# EAGLE design pcb (EAGLE 7.6.0)
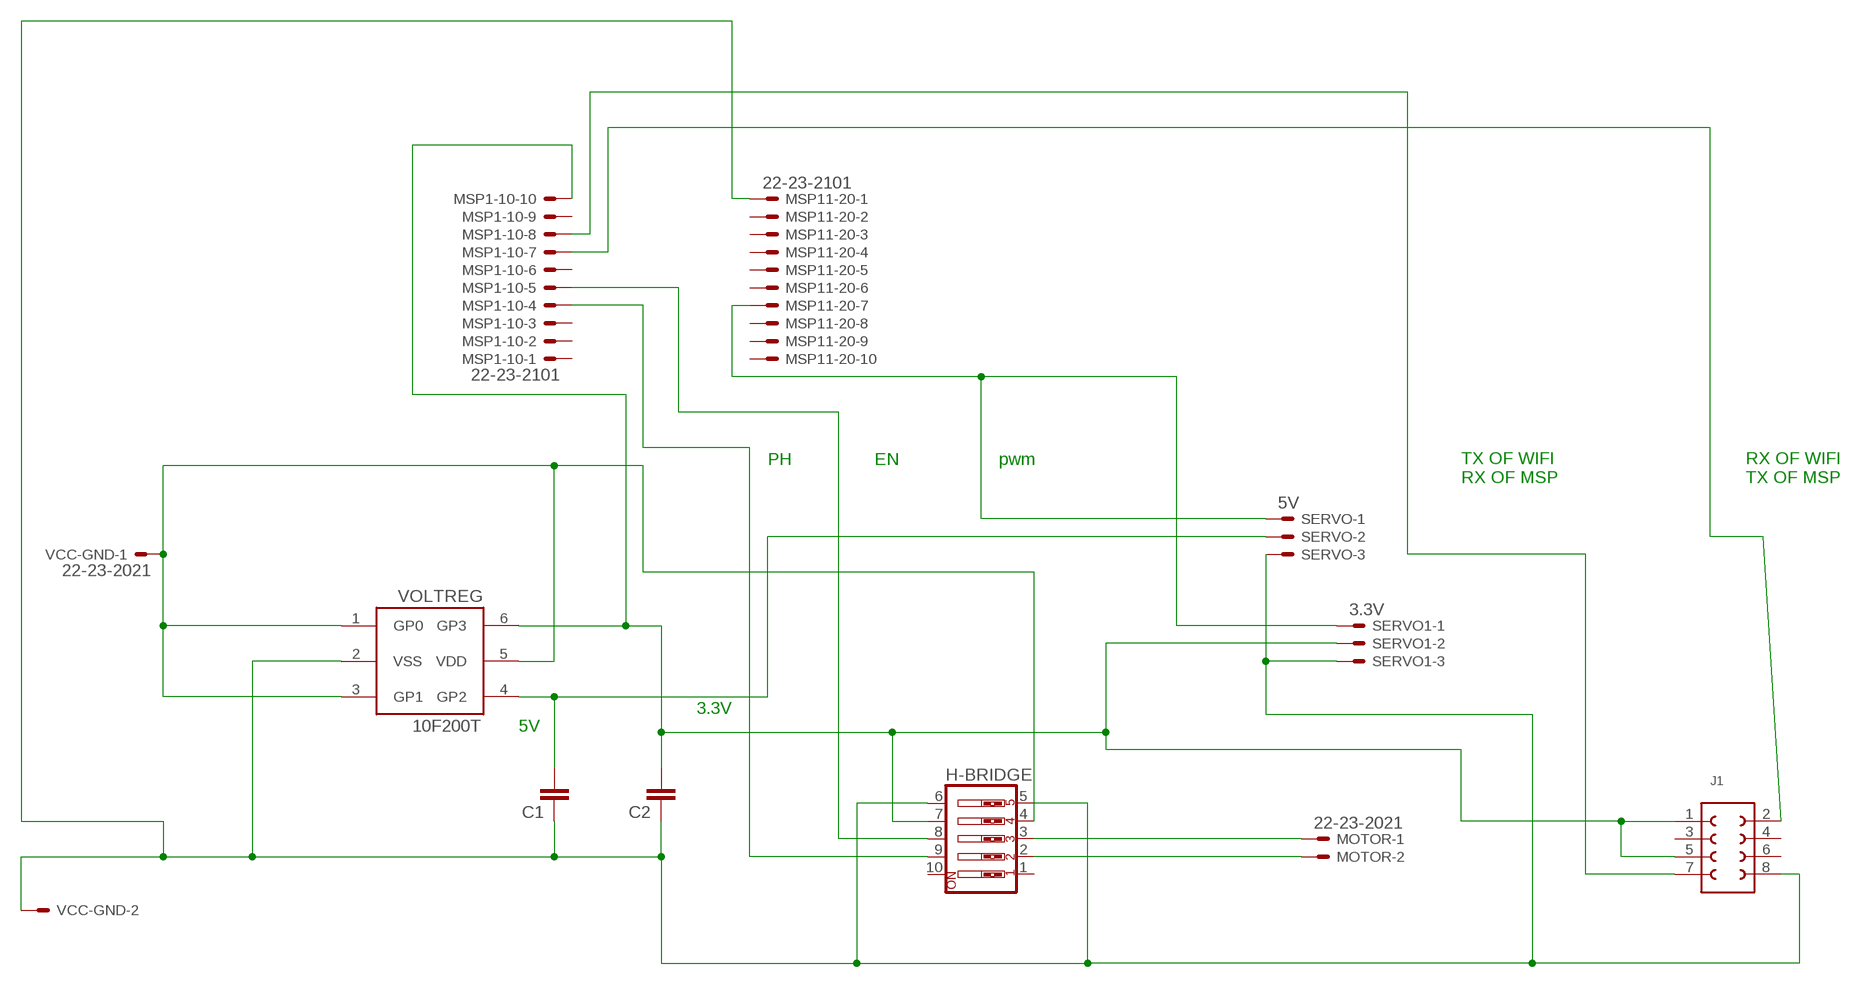
[diagram p0: schematic, sheet 1]

## Parts
C1  C2,5-3  [C2.5-3]
C2  C2,5-3  [C2.5-3]
H-BRIDGE  SW_DIP-5  [EDG-05]
J1  61300821121  [61300821121]
MOTOR  22-23-2021  [22-23-2021]
MSP1-10  22-23-2101  [22-23-2101]
MSP11-20  22-23-2101  [22-23-2101]
SERVO  5V  22-23-2031  [22-23-2031]
SERVO1  3.3V  22-23-2031  [22-23-2031]
VCC-GND  22-23-2021  [22-23-2021]
VOLTREG  10F200T  [SOT23-6]

## Nets
N$1: J1.2 MSP1-10.7
N$3: J1.7 MSP1-10.8
N$4: C2.2 H-BRIDGE.7 J1.1 J1.5 MSP1-10.10 SERVO1.2 VOLTREG.6(GP3)
N$5: H-BRIDGE.3 MOTOR.1
N$6: H-BRIDGE.2 MOTOR.2
N$7: MSP11-20.7 SERVO1.1 SERVO.1
N$10: C1.2 SERVO.2 VOLTREG.4(GP2)
N$11: H-BRIDGE.8 MSP1-10.5
N$12: C1.1 C2.1 H-BRIDGE.5 H-BRIDGE.6 J1.8 MSP11-20.1 SERVO1.3 SERVO.3 VCC-GND.2 VOLTREG.2(VSS)
N$13: H-BRIDGE.9 MSP1-10.4
N$14: H-BRIDGE.4 VCC-GND.1 VOLTREG.1(GP0) VOLTREG.3(GP1) VOLTREG.5(VDD)
Unconnected: H-BRIDGE.1 H-BRIDGE.10 J1.3 J1.4 J1.6 MSP1-10.1 MSP1-10.2 MSP1-10.3 MSP1-10.6 MSP1-10.9 MSP11-20.2 MSP11-20.3 MSP11-20.4 MSP11-20.5 MSP11-20.6 MSP11-20.8 MSP11-20.9 MSP11-20.10

## Notes on the sheet
- PH | EN | pwm
- TX OF WIFI
  RX OF MSP
- RX OF WIFI
  TX OF MSP
- 3.3V
- 5V

## Library data of the parts
C1 C2 = capacitor-wima:C: CAPACITOR naming: grid - package width
H-BRIDGE = special:SW_DIP-5: DIP SWITCH
J1 = Board-to-Board (rev17e):61300821121: Wr-PHD 2.54mm Dual Pin Header, 8 Pins =>Code : Con_BTB_PHD_2.54_2_61300821121 <http://katalog.we-online.de/media/images/eican/Con_BTB_PHD_2.54_2_6130xx21121_pf2.jpg> Details see: http://katalog.we-online.de/en/em/613_0xx_211_21 Created 2014-05-29, Karrer Zheng 2014 (C) Würth Elektronik
MOTOR VCC-GND = con-molex:22-23-2021: .100" (2.54mm) Center Header - 2 Pin; MF: MOLEX; MPN: 22-23-2021; OC_FARNELL: 1462926; OC_NEWARK: 25C3832
MSP1-10 MSP11-20 = con-molex:22-23-2101: .100" (2.54mm) Center Header - 10 Pin; MF: MOLEX; MPN: 22-23-2101; OC_FARNELL: 1756828; OC_NEWARK: 94C0765
SERVO SERVO1 = con-molex:22-23-2031: .100" (2.54mm) Center Header - 3 Pin; MF: MOLEX; MPN: 22-23-2031; OC_FARNELL: 1462950; OC_NEWARK: 30C0862
VOLTREG = adafruit:10F200T: PIC10F200/202/204/206 Ultra-small 8-bit PIC micros in SOT-23-6 and SOIC

## Board
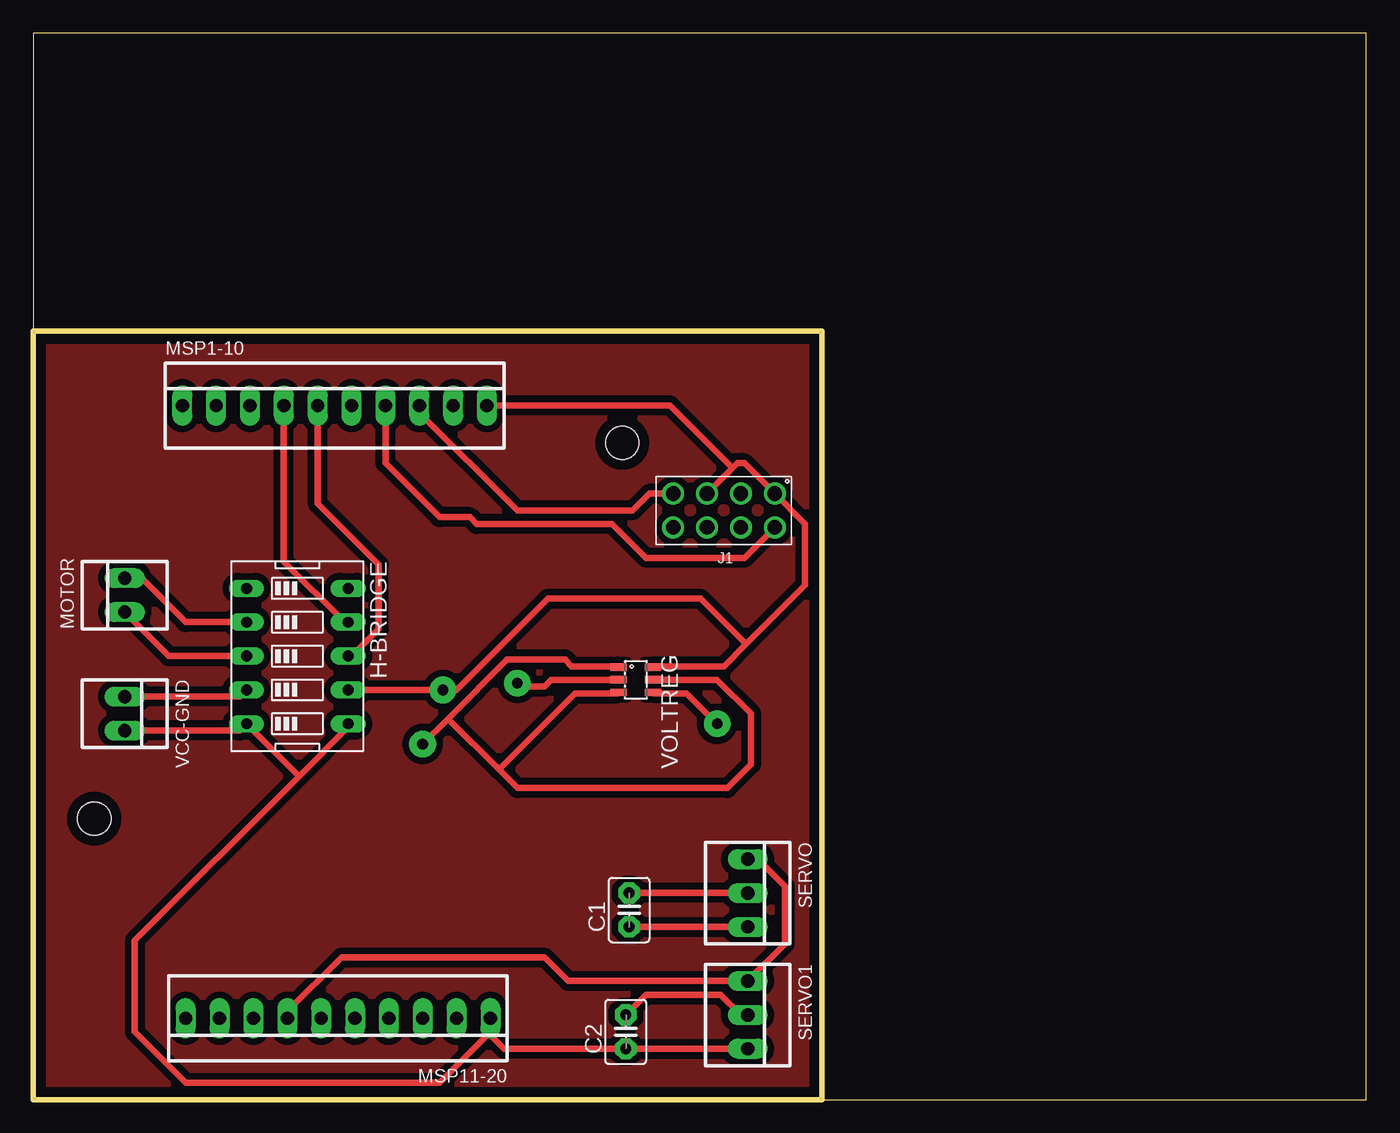
[diagram p1: board, top side]
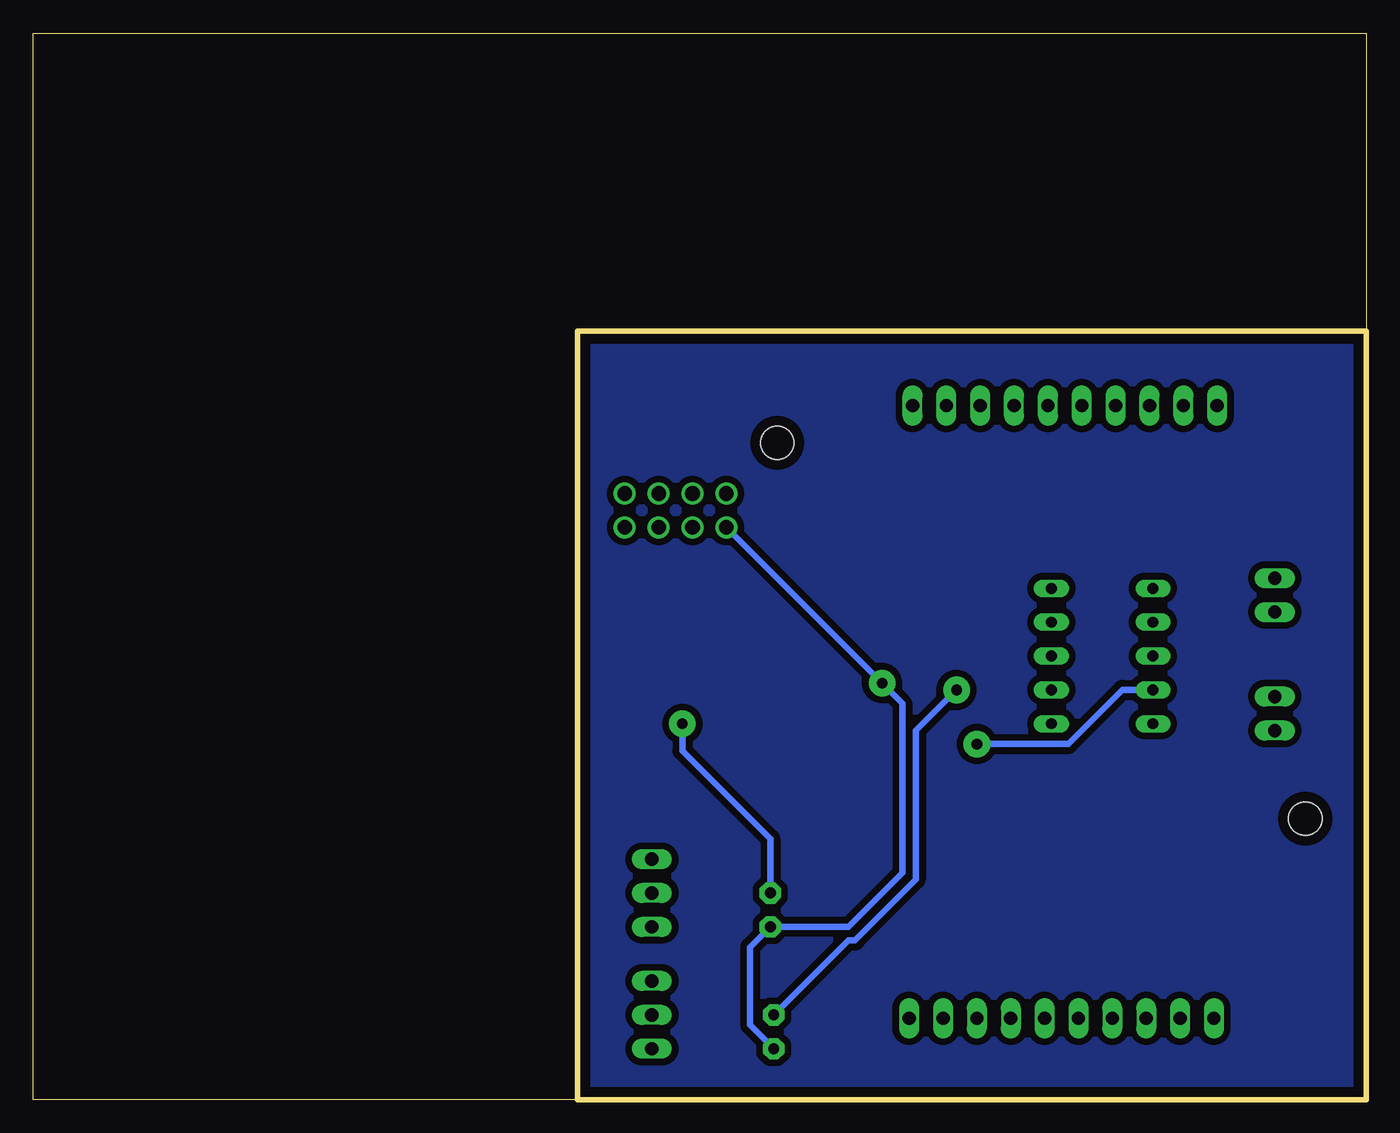
[diagram p2: board, bottom side, seen from below]

Size 100 x 80 mm. Coordinates in mm from the lower left corner, seen from the top.
Outline: 59.18,0 100,0 100,80 0,80 0,0
Outline: 0,0 59.18,0
Outline: 59.18,0 59.18,57.66 0,57.66 0,0
Copper layers (1*16): Top 0.035mm / dielectric 1.5mm / Bottom 0.035mm
Design rules "default *": minimum track width 0.5mm, minimum drill 0.8mm, track to track 0.5mm, track to pad 0.5mm, pad to pad 0.5mm, via to via 0.5mm, smd to smd 8mil, copper to edge 30mil, drill to drill 30mil, minimum pad ring 10mil, minimum via ring 8mil, stop-mask expansion 4mil, vias tented up to drill 0mil, thermal gap 10mil
Holes 2.5 mm at 4.57,21.08 44.2,49.28

### Footprints (pad centres in the part's own frame; a part is rotated, then mirrored left to right if it is on the bottom)
C2.5-3 = drill 0.813 pad 1.6 octagon: 1 -1.27,0; 2 1.27,0
EDG-05 = drill 0.813 long: 1 -5.08,-3.81; 2 -2.54,-3.81; 3 0,-3.81; 4 2.54,-3.81; 5 5.08,-3.81; 6 5.08,3.81; 7 2.54,3.81; 8 0,3.81; 9 -2.54,3.81; 10 -5.08,3.81
61300821121 = drill 1.1: 1 -3.81,-1.27; 2 -3.81,1.27; 3 -1.27,-1.27; 4 -1.27,1.27; 5 1.27,-1.27; 6 1.27,1.27; 7 3.81,-1.27; 8 3.81,1.27
22-23-2021 = drill 1 long: 1 -1.27,0; 2 1.27,0
22-23-2101 = drill 1 long: 1 -11.43,0; 2 -8.89,0; 3 -6.35,0; 4 -3.81,0; 5 -1.27,0; 6 1.27,0; 7 3.81,0; 8 6.35,0; 9 8.89,0; 10 11.43,0
22-23-2031 = drill 1 long: 1 -2.54,0; 2 0,0; 3 2.54,0
SOT23-6 = smd 0.55 x 1.2: 1 -0.95,-1.3; 2 0,-1.3; 3 0.95,-1.3; 4 0.95,1.3; 5 0,1.3; 6 -0.95,1.3

### Placement (x,y rotation side)
C1  44.7,14.22 90 top
C2  44.45,5.08 90 top
H-BRIDGE  19.81,33.27 270 top
J1  51.82,44.2 180 top
MOTOR  6.86,37.85 90 top
MSP1-10  22.61,52.07 0 top
MSP11-20  22.86,6.1 180 top
SERVO  53.59,15.49 270 top
SERVO1  53.59,6.35 270 top
VCC-GND  6.86,28.96 270 top
VOLTREG  45.21,31.5 270 top

### Tracks (layer width: path | path; a pad name or v marks a point on that pad's centre or on a via)
N$1
  Top 0.5: MSP1-10.7 26.42,47.75 30.48,43.69 32.77,43.69 33.27,43.18 43.43,43.18 45.97,40.64 53.34,40.64 J1.2
N$3
  Top 0.5: MSP1-10.8 28.96,51.56 36.32,44.2 44.96,44.2 46.23,45.47 J1.7
N$4  (via drill 0.8 pad 2)
  Top 0.5: C2.2 45.97,7.87 51.56,7.87 53.09,6.35 SERVO1.2 | 52.45,47.37 52.83,47.75 53.34,47.75 J1.1 57.91,43.18 57.91,38.61 53.47,34.16 | 52.45,47.37 J1.5 | 52.45,47.37 47.75,52.07 MSP1-10.10 | H-BRIDGE.7 v30.73,30.73 31.75,30.73 38.61,37.59 50.04,37.59 53.47,34.16 | VOLTREG.6 46.58,32.51 51.82,32.51 53.47,34.16
  Bottom 0.5: C2.2 38.86,11.94 38.35,11.94 33.78,16.51 33.78,27.69 v30.73,30.73
N$5
  Top 0.5: H-BRIDGE.3 10.16,33.27 MOTOR.1
N$6
  Top 0.5: H-BRIDGE.2 11.43,35.81 8.13,39.12 MOTOR.2
N$7
  Top 0.5: MSP11-20.7 19.05,6.6 23.11,10.67 38.35,10.67 40.13,8.89 SERVO1.1 56.39,11.68 56.39,16 54.36,18.03 SERVO.1
N$9
  pour Top: 0,57.66 59.18,57.66 59.18,0 0,0
N$10  (via drill 0.8 pad 2)
  Top 0.5: SERVO.2 C1.2 | VOLTREG.4 46.58,30.48 49.02,30.48 v51.31,28.19
  Bottom 0.5: v51.31,28.19 51.31,26.16 44.7,19.56 C1.2
N$11
  Top 0.5: H-BRIDGE.8 23.88,33.27 25.91,35.31 25.91,40.13 21.34,44.7 MSP1-10.5
N$12  (via drill 0.8 pad 2)
  Top 0.5: C1.1 SERVO.3 | VCC-GND.2 15.49,27.69 H-BRIDGE.5 19.94,24.26 | 19.94,24.26 23.62,27.94 H-BRIDGE.6 | SERVO1.3 C2.1 35.31,3.81 34.29,4.83 MSP11-20.1 34.29,5.08 30.48,1.27 11.43,1.27 7.62,5.08 7.62,11.94 19.94,24.26 | v36.32,31.24 36.32,30.99 38.35,30.99 38.86,31.5 VOLTREG.2
  Bottom 0.5: C2.1 46.23,5.59 46.23,11.43 C1.1 38.86,12.95 34.8,17.02 34.8,29.72 v36.32,31.24 J1.8
N$13
  Top 0.5: MSP1-10.4 18.8,40.39 23.37,35.81 H-BRIDGE.9
N$14  (via drill 0.8 pad 2)
  Top 0.5: 43.5,32.45 VOLTREG.1 43.85,32.51 40.39,32.51 39.88,33.02 35.56,33.02 31.11,28.57 | VCC-GND.1 15.49,30.23 H-BRIDGE.4 | 31.11,28.57 v29.21,26.67 | 34.92,24.77 36.32,23.37 52.07,23.37 53.85,25.15 53.85,28.96 51.31,31.5 VOLTREG.5 | 34.92,24.77 31.11,28.57 | 34.92,24.77 40.64,30.48 43.85,30.48 VOLTREG.3
  Bottom 0.5: H-BRIDGE.4 18.29,30.73 22.35,26.67 v29.21,26.67
N$15
  pour Bottom: 59.18,0 59.18,57.66 0,57.66 0,0